# Altium schematic sheet Analog Front End.SchDoc
size A3; Author: Jean Callus; CompanyName: RATON; DrawnBy: Jean Callus; Organization: RATON; Revision: 0; SheetNumber: 4; SheetTotal: 4; ImagePath: C:\Users\callu\Documents\University\Thesis\Misc\UoMLogo.jpg
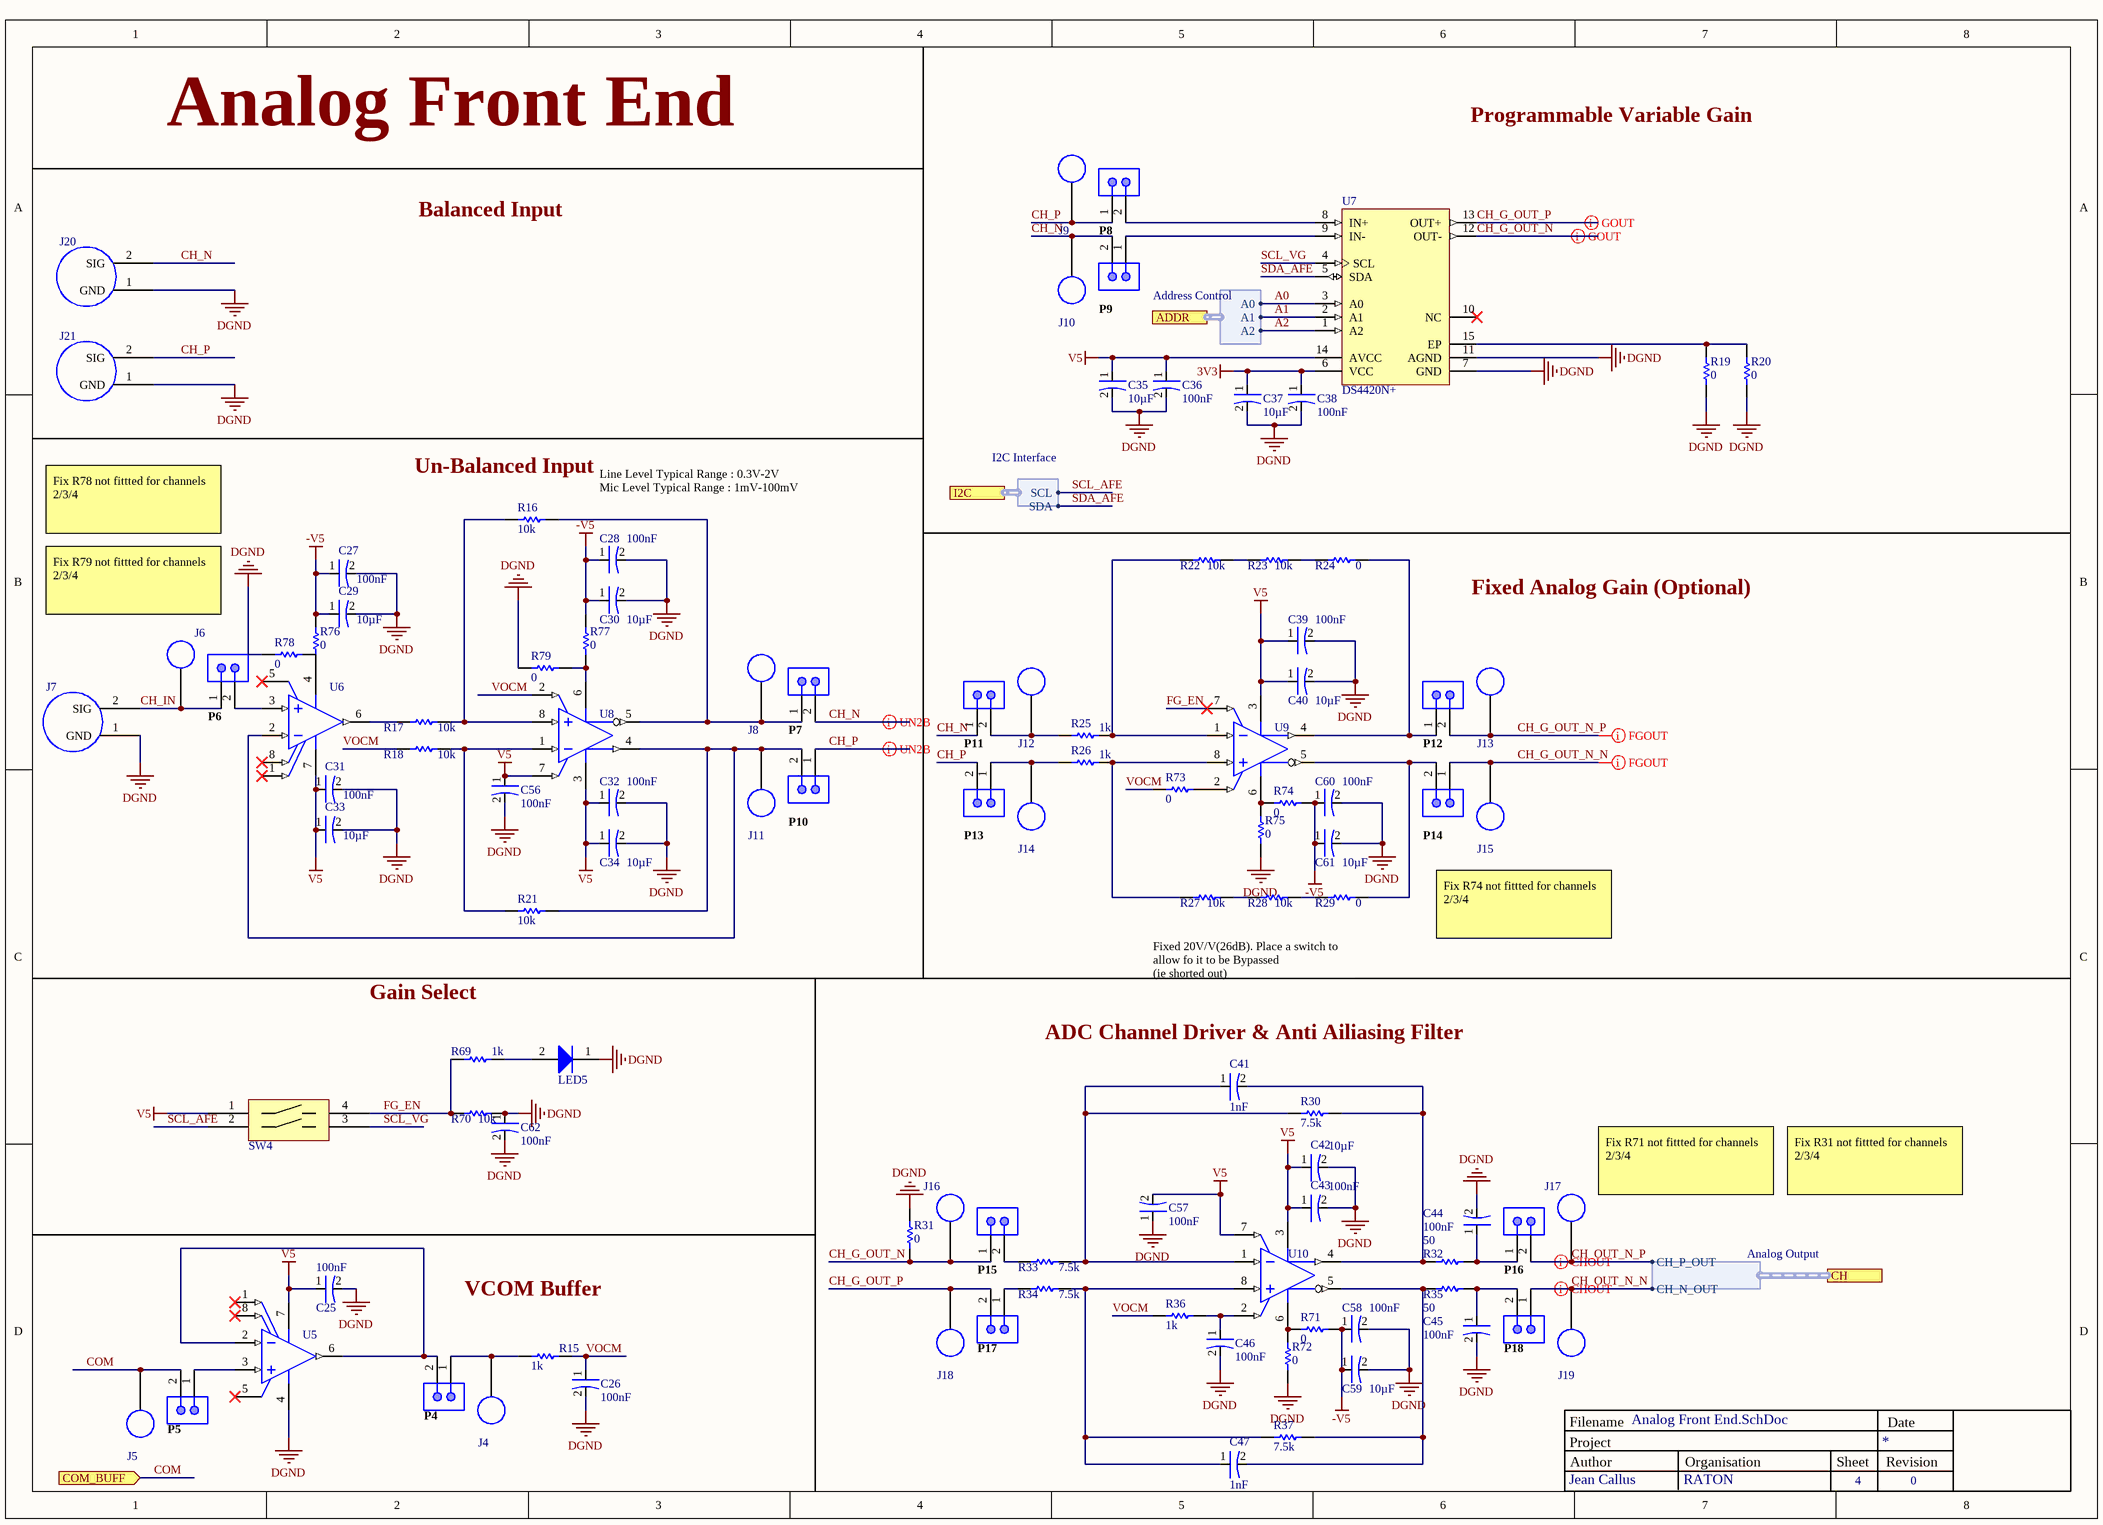
[diagram p0: Analog Front End.SchDoc]

## Parts
C25  value 100nF  [0805-M]  (hidden comment: CAP 0.1uF CER 0805 50V  X7R 5%)
C26  value 100nF  [0805-M]  (hidden comment: CAP 0.1uF CER 0805 50V  X7R 5%)
C27  value 100nF  [0805-M]  (hidden comment: CAP 0.1uF CER 0805 50V  X7R 5%)
C28  value 100nF  [0805-M]  (hidden comment: CAP 0.1uF CER 0805 50V  X7R 5%)
C29  value 10µF  [0805-M]  (hidden comment: CAP 10uF CER 0805 25V X5R 10%)
C30  value 10µF  [0805-M]  (hidden comment: CAP 10uF CER 0805 25V X5R 10%)
C31  value 100nF  [0805-M]  (hidden comment: CAP 0.1uF CER 0805 50V  X7R 5%)
C32  value 100nF  [0805-M]  (hidden comment: CAP 0.1uF CER 0805 50V  X7R 5%)
C33  value 10µF  [0805-M]  (hidden comment: CAP 10uF CER 0805 25V X5R 10%)
C34  value 10µF  [0805-M]  (hidden comment: CAP 10uF CER 0805 25V X5R 10%)
C35  value 10µF  [0805-M]  (hidden comment: CAP 10uF CER 0805 25V X5R 10%)
C36  value 100nF  [0805-M]  (hidden comment: CAP 0.1uF CER 0805 50V  X7R 5%)
C37  value 10µF  [0805-M]  (hidden comment: CAP 10uF CER 0805 25V X5R 10%)
C38  value 100nF  [0805-M]  (hidden comment: CAP 0.1uF CER 0805 50V  X7R 5%)
C39  value 100nF  [0805-M]  (hidden comment: CAP 0.1uF CER 0805 50V  X7R 5%)
C40  value 10µF  [0805-M]  (hidden comment: CAP 10uF CER 0805 25V X5R 10%)
C41  value 1nF  [0805-M]  (hidden comment: CAP 1nF CER 0805 25V X7R 5%)
C42  value 10µF  [0805-M]  (hidden comment: CAP 10uF CER 0805 25V X5R 10%)
C43  value 100nF  [0805-M]  (hidden comment: CAP 0.1uF CER 0805 50V  X7R 5%)
C44  value 100nF  [0805-M]  (hidden comment: CAP 0.1uF CER 0805 50V  X7R 5%)
C45  value 100nF  [0805-M]  (hidden comment: CAP 0.1uF CER 0805 50V  X7R 5%)
C46  value 100nF  [0805-M]  (hidden comment: CAP 0.1uF CER 0805 50V  X7R 5%)
C47  value 1nF  [0805-M]  (hidden comment: CAP 1nF CER 0805 25V X7R 5%)
C56  value 100nF  [0805-M]  (hidden comment: CAP 0.1uF CER 0805 50V  X7R 5%)
C57  value 100nF  [0805-M]  (hidden comment: CAP 0.1uF CER 0805 50V  X7R 5%)
C58  value 100nF  [0805-M]  (hidden comment: CAP 0.1uF CER 0805 50V  X7R 5%)
C59  value 10µF  [0805-M]  (hidden comment: CAP 10uF CER 0805 25V X5R 10%)
C60  value 100nF  [0805-M]  (hidden comment: CAP 0.1uF CER 0805 50V  X7R 5%)
C61  value 10µF  [0805-M]  (hidden comment: CAP 10uF CER 0805 25V X5R 10%)
C62  value 100nF  [0805-M]  (hidden comment: CAP 0.1uF CER 0805 50V  X7R 5%)
J4  151-203-RC  [151-203-RC-Footprint-1]  (value not drawn)
J5  151-203-RC  [151-203-RC-Footprint-1]  (value not drawn)
J6  151-203-RC  [151-203-RC-Footprint-1]  (value not drawn)
J7  SMA CONNECTOR  [SMA CONNECTOR-Footprint-1]  (value not drawn)
J8  151-203-RC  [151-203-RC-Footprint-1]  (value not drawn)
J9  151-203-RC  [151-203-RC-Footprint-1]  (value not drawn)
J10  151-203-RC  [151-203-RC-Footprint-1]  (value not drawn)
J11  151-203-RC  [151-203-RC-Footprint-1]  (value not drawn)
J12  151-203-RC  [151-203-RC-Footprint-1]  (value not drawn)
J13  151-203-RC  [151-203-RC-Footprint-1]  (value not drawn)
J14  151-203-RC  [151-203-RC-Footprint-1]  (value not drawn)
J15  151-203-RC  [151-203-RC-Footprint-1]  (value not drawn)
J16  151-203-RC  [151-203-RC-Footprint-1]  (value not drawn)
J17  151-203-RC  [151-203-RC-Footprint-1]  (value not drawn)
J18  151-203-RC  [151-203-RC-Footprint-1]  (value not drawn)
J19  151-203-RC  [151-203-RC-Footprint-1]  (value not drawn)
J20  SMA CONNECTOR  [SMA CONNECTOR-Footprint-1]  (value not drawn)
J21  SMA CONNECTOR  [SMA CONNECTOR-Footprint-1]  (value not drawn)
LED5  LED 0603 Red 20mA 1.7V  [0603 Generic]  (value not drawn)
P4  GENERIC 2PIN HEADER MALE  [GENERIC 2PIN HEADER 0]  (value not drawn)
P5  GENERIC 2PIN HEADER MALE  [GENERIC 2PIN HEADER 0]  (value not drawn)
P6  GENERIC 2PIN HEADER MALE  [GENERIC 2PIN HEADER 0]  (value not drawn)
P7  GENERIC 2PIN HEADER MALE  [GENERIC 2PIN HEADER 0]  (value not drawn)
P8  GENERIC 2PIN HEADER MALE  [GENERIC 2PIN HEADER 0]  (value not drawn)
P9  GENERIC 2PIN HEADER MALE  [GENERIC 2PIN HEADER 0]  (value not drawn)
P10  GENERIC 2PIN HEADER MALE  [GENERIC 2PIN HEADER 0]  (value not drawn)
P11  GENERIC 2PIN HEADER MALE  [GENERIC 2PIN HEADER 0]  (value not drawn)
P12  GENERIC 2PIN HEADER MALE  [GENERIC 2PIN HEADER 0]  (value not drawn)
P13  GENERIC 2PIN HEADER MALE  [GENERIC 2PIN HEADER 0]  (value not drawn)
P14  GENERIC 2PIN HEADER MALE  [GENERIC 2PIN HEADER 0]  (value not drawn)
P15  GENERIC 2PIN HEADER MALE  [GENERIC 2PIN HEADER 0]  (value not drawn)
P16  GENERIC 2PIN HEADER MALE  [GENERIC 2PIN HEADER 0]  (value not drawn)
P17  GENERIC 2PIN HEADER MALE  [GENERIC 2PIN HEADER 0]  (value not drawn)
P18  GENERIC 2PIN HEADER MALE  [GENERIC 2PIN HEADER 0]  (value not drawn)
R15  value 1k  [0805-M]  (hidden comment: RES 1k 0805 125mW 5%)
R16  value 10k  [0402-M]  (hidden comment: RES 10k 0402 63mW 5%)
R17  value 10k  [0402-M]  (hidden comment: RES 10k 0402 63mW 5%)
R18  value 10k  [0402-M]  (hidden comment: RES 10k 0402 63mW 5%)
R19  value 0  [0402-M]  (hidden comment: RES 0 0402 63mW)
R20  value 0  [0402-M]  (hidden comment: RES 0 0402 63mW)
R21  value 10k  [0402-M]  (hidden comment: RES 10k 0402 63mW 5%)
R22  value 10k  [0805-M]  (hidden comment: RES 10k 0805 125mW 1%)
R23  value 10k  [0805-M]  (hidden comment: RES 10k 0805 125mW 1%)
R24  value 0  [0402-M]  (hidden comment: RES 0 0402 63mW)
R25  value 1k  [0805-M]  (hidden comment: RES 1k 0805 125mW 5%)
R26  value 1k  [0805-M]  (hidden comment: RES 1k 0805 125mW 5%)
R27  value 10k  [0805-M]  (hidden comment: RES 10k 0805 125mW 1%)
R28  value 10k  [0805-M]  (hidden comment: RES 10k 0805 125mW 1%)
R29  value 0  [0402-M]  (hidden comment: RES 0 0402 63mW)
R30  value 7.5k  [0402-M]  (hidden comment: RES 7.5k 0402 63mW 5%)
R31  value 0  [0402-M]  (hidden comment: RES 0 0402 63mW)
R32  value 50  [0805-L]  (hidden comment: RES 50 0805 125mW 1%)
R33  value 7.5k  [0402-M]  (hidden comment: RES 7.5k 0402 63mW 5%)
R34  value 7.5k  [0402-M]  (hidden comment: RES 7.5k 0402 63mW 5%)
R35  value 50  [0805-L]  (hidden comment: RES 50 0805 125mW 1%)
R36  value 1k  [0805-M]  (hidden comment: RES 1k 0805 125mW 5%)
R37  value 7.5k  [0402-M]  (hidden comment: RES 7.5k 0402 63mW 5%)
R69  value 1k  [0805-M]  (hidden comment: RES 1k 0805 125mW 5%)
R70  value 10k  [0805-M]  (hidden comment: RES 10k 0805 125mW 1%)
R71  value 0  [0402-M]  (hidden comment: RES 0 0402 63mW)
R72  value 0  [0402-M]  (hidden comment: RES 0 0402 63mW)
R73  value 0  [0402-M]  (hidden comment: RES 0 0402 63mW)
R74  value 0  [0402-M]  (hidden comment: RES 0 0402 63mW)
R75  value 0  [0402-M]  (hidden comment: RES 0 0402 63mW)
R76  value 0  [0402-M]  (hidden comment: RES 0 0402 63mW)
R77  value 0  [0402-M]  (hidden comment: RES 0 0402 63mW)
R78  value 0  [0402-M]  (hidden comment: RES 0 0402 63mW)
R79  value 0  [0402-M]  (hidden comment: RES 0 0402 63mW)
SW4  210-2MS  [210-2MS-Footprint-1]  (value not drawn)
U5  OPA227UA/2K5  [D0008A_L]  (value not drawn)
U6  OPA227UA/2K5  [D0008A_L]  (value not drawn)
U7  DS4420N+  [QFN50P400X300X75_HS-15N]
U8  OPA1632DR  [D0008A_L]  (value not drawn)
U9  OPA1632DR  [D0008A_L]  (value not drawn)
U10  OPA1632DR  [D0008A_L]  (value not drawn)

## Ports
ADDR (harness Address Control), CH (harness Analog Output), COM_BUFF (in), I2C (harness I2C Interface)

## Harnesses
Analog Output: CH_P_OUT, CH_N_OUT
Address Control: A0, A1, A2
I2C Interface: SCL, SDA

## Nets
3V3: C37.1(Anode) C38.1(Anode) U7.6(VCC)
-V5: C27.1(Anode) C28.1(Anode) C29.1(Anode) C30.1(Anode) C58.1(Anode) C59.1(Anode) C60.1(Anode) C61.1(Anode) R71.2 R74.1 R76.1 R77.2
DGND: C25.2(Cathode) C26.2(Cathode) C27.2(Cathode) C28.2(Cathode) C29.2(Cathode) C30.2(Cathode) C31.2(Cathode) C32.2(Cathode) C33.2(Cathode) C34.2(Cathode) C35.2(Cathode) C36.2(Cathode) C37.2(Cathode) C38.2(Cathode) C39.2(Cathode) C40.2(Cathode) C42.2(Cathode) C43.2(Cathode) C44.2(Cathode) C45.2(Cathode) C46.2(Cathode) C56.2(Cathode) C57.1(Anode) C58.2(Cathode) C59.2(Cathode) C60.2(Cathode) C61.2(Cathode) C62.1(Anode) C62.2(Cathode) J7.1(GND) J20.1(GND) J21.1(GND) LED5.1 R19.1 R20.1 R31.1 R70.2 R72.1 R75.2 R78.1 R79.1 U5.4(V-) U7.7(GND) U7.11(AGND)
V5: C25.1(Anode) C31.1(Anode) C32.1(Anode) C33.1(Anode) C34.1(Anode) C35.1(Anode) C36.1(Anode) C39.1(Anode) C40.1(Anode) C42.1(Anode) C43.1(Anode) C56.1(Anode) C57.2(Cathode) SW4.1 U5.7(V+) U6.7(V+) U7.14(AVCC) U8.3(V+) U8.7(ENABLE) U9.3(V+) U10.3(V+) U10.7(ENABLE)
A0: U7.3(A0) ; port ADDR.A0
A1: U7.2(A1) ; port ADDR.A1
A2: U7.1(A2) ; port ADDR.A2
CH_G_OUT_N: J16.1 P15.1 R31.2 U7.12(OUT-)
CH_G_OUT_N_N: J15.1 P14.1
CH_G_OUT_N_P: J13.1 P12.2
CH_G_OUT_P: J18.1 P17.2 U7.13(OUT+)
CH_IN: J6.1 J7.2(SIG) P6.1
CH_N: J10.1 J20.2(SIG) P7.2 P9.2 P11.1
CH_OUT_N_N: J19.1 P18.1 ; port CH.CH_N_OUT
CH_OUT_N_P: J17.1 P16.2 ; port CH.CH_P_OUT
CH_P: J9.1 J21.2(SIG) P8.1 P10.1 P13.2
COM: J5.1 P5.2 ; port COM_BUFF
FG_EN: R69.1 R70.1 SW4.4 U9.7(ENABLE)
SCL_AFE: SW4.2 ; port I2C.SCL
SCL_VG: SW4.3 U7.4(SCL)
SDA_AFE: U7.5(SDA) ; port I2C.SDA
VOCM: C26.1(Anode) R15.2 R18.1 R36.1 R73.2 U8.2(VOCM)
NetC41_1: C41.1(Anode) R30.1 R33.2 U10.1(VIN-)
NetC41_2: C41.2(Cathode) R30.2 R32.1 U10.4(VOUT+)
NetC44_1: C44.1(Anode) P16.1 R32.2
NetC45_1: C45.1(Anode) P18.2 R35.2
NetC46_1: C46.1(Anode) R36.2 U10.2(VOCM)
NetC47_1: C47.1(Anode) R34.2 R37.1 U10.8(VIN+)
NetC47_2: C47.2(Cathode) R35.1 R37.2 U10.5(VOUT-)
NetJ4_1: J4.1 P4.1 R15.1
NetJ8_1: J8.1 P7.1 R16.2 U8.5(VOUT-)
NetJ11_1: J11.1 P10.2 R21.2 U6.2(IN-) U8.4(VOUT+)
NetJ12_1: J12.1 P11.2 R25.2
NetJ14_1: J14.1 P13.1 R26.2
NetLED5_2: LED5.2 R69.2
NetP4_2: P4.2 U5.2(IN-) U5.6(OUT)
NetP5_1: P5.1 U5.3(IN+)
NetP6_2: P6.2 U6.3(IN+)
NetP8_2: P8.2 U7.8(IN+)
NetP9_1: P9.1 U7.9(IN-)
NetP12_1: P12.1 R24.2 U9.4(VOUT+)
NetP14_2: P14.2 R29.2 U9.5(VOUT-)
NetP15_2: P15.2 R33.1
NetP17_1: P17.1 R34.1
NetR16_1: R16.1 R17.2 U8.8(VIN+)
NetR17_1: R17.1 U6.6(OUT)
NetR18_2: R18.2 R21.1 U8.1(VIN-)
NetR19_2: R19.2 R20.2 U7.15(EP)
NetR22_1: R22.1 R25.1 U9.1(VIN-)
NetR22_2: R22.2 R23.1
NetR23_2: R23.2 R24.1
NetR26_1: R26.1 R27.1 U9.8(VIN+)
NetR27_2: R27.2 R28.1
NetR28_2: R28.2 R29.1
NetR71_1: R71.1 R72.2 U10.6(V-)
NetR73_1: R73.1 U9.2(VOCM)
NetR74_2: R74.2 R75.1 U9.6(V-)
NetR76_2: R76.2 U6.4(V-)
NetR77_1: R77.1 R79.2 U8.6(V-)

Not connected (* = marked no-connect by the designer): R78 2; U5 1(TRIM)* 5(NC)* 8(TRIM)*; U6 1(TRIM)* 5(NC)* 8(TRIM)*; U7 10(NC)*

## Layout directives
differential pair: CH_G_OUT_N, CH_G_OUT_N_N, CH_G_OUT_N_P, CH_G_OUT_P, CH_N, CH_OUT_N_N, CH_OUT_N_P, CH_P

## Notes on the sheet
- Analog Front End
- Programmable Variable Gain
- Balanced Input
- (near R16) Un-Balanced Input
- Fix R78 not fittted for channels 2/3/4
- Line Level Typical Range : 0.3V-2V
  Mic Level Typical Range : 1mV-100mV
- Fixed Analog Gain (Optional)
- Fix R79 not fittted for channels 2/3/4
- Fix R74 not fittted for channels 2/3/4
- Gain Select
- Fixed 20V/V(26dB). Place a switch to allow fo it to be Bypassed
  (ie shorted out)
- (near C41) ADC Channel Driver & Anti Ailiasing Filter
- (near J17) Fix R71 not fittted for channels 2/3/4
- Fix R31 not fittted for channels 2/3/4
- VCOM Buffer
- Project
- Filename
- Author
- Organisation
- Sheet
- Revision
- Date
  Date

## Library data of the parts
C25-C28 C31 C32 C36 C38 C39 C43-C46 C56-C58 C60 C62 = CAP 0.1uF CER 0805 50V  X7R 5%-2: CAP-0.1uF-CER-0805-50V- X7R-5%; Manufacturer: Generic; Bin: F1-C6-4; Type: SMD; Design Item ID: CAP 0.1uF CER 0805 50V  X7R 5%; Supplier 1: Mouser; Datasheet: http://www.kemet.com/Lists/ProductCatalog/Attachments/53/KEM_C1002_X7R_SMD.pdf; Source: Capacitor Library.SchLib; Case/Package: 0805; Status: Active; Supplier Part Number 1: 80-C0805C104J3R
C29 C30 C33-C35 C37 C40 C42 C59 C61 = CAP 10uF CER 0805 25V X5R 10%-2: CAP-10uF-CER-0805-25V-X5R-10%; Manufacturer: Generic; Type: SMD; Bin: F1-C1-4; Supplier 1: Mouser; Case/Package: 0805; Source: Capacitor Library.SchLib; Supplier Part Number 1: 80-C0805C106K8P; Status: Active; Design Item ID: CAP 10uF CER 0805 25V X5R 10%
C41 C47 = CAP 1nF CER 0805 25V X7R 5%-2: Manufacturer: Generic; Bin: N; Type: SMD; Source: Capacitor Library.SchLib; Datasheet: http://www.mouser.com/ds/2/212/KEM_C1002_X7R_SMD-357932.pdf; Supplier 1: Mouser; Status: Active; Design Item ID: CAP 1nF CER 0805 25V X7R 5%; Supplier Part Number 1: 77-VJ0805Y102JXXPBC; Case/Package: 0805
J4-J6 J8-J19 = CMP-002-00000-2: PCB-Probe-Ring; Color: Black
J7 J20 J21 = CMP-002-00001-2: Manufacturer: LPRS; Connector Type: SMA,Coaxial; Max Frequency: 6GHz; Impedance: 50R; Supplier No: 471-SMACONNECTOR; Contact Material: Gold; Supplier: Mouser; REACH SVHC: No SVHC; Case/Package: SMA; Contact Plating: Gold
LED5 = LED 0603 Red 20mA 1.7V-1: LED-0603-Red-20mA-1.7V-STOCK; Manufacturer: Generic; Bin: F2-DM1-2; Type: SMD; Supplier Part Number 1: 67-1551-6-ND; Design Item ID: LED 0603 Red 20mA 1.7V; Status: Active; Case/Package: 0603; Source: Diode Library.SchLib; Supplier 1: Digi-Key
P4-P18 = GENERIC 2PIN HEADER MALE-2: CONN MAL TH 2 0Deg HEADER; Bin: B3-J5; Manufacturer: Generic; Design Item ID: GENERIC 2PIN HEADER MALE; Type: TH; Status: Active; Source: Connector Library.SchLib; Case/Package: n/a PIN
R15 R25 R26 R36 R69 = RES 1k 0805 125mW 5%-1: RES-1k-0805-125mW-5%; Manufacturer: Generic; Bin: F1-R12-6; MAPPING: 1(2,1,30.9k); Design Item ID: RES 1k 0805 125mW 5%; Case/Package: 0805; Status: Active; Source: Resistor Library.SchLib; Type: SMD
R16-R18 R21 = RES 10k 0402 63mW 5%-1: RES-10k-0402-63mW-5%; Manufacturer: Generic; Bin: F1-R7-9; MAPPING: 1(2,1,11.5k); Design Item ID: RES 10k 0402 63mW 5%; Type: SMD; Status: Active; Case/Package: 0402; Source: Resistor Library.SchLib
R19 R20 R24 R29 R31 R71-R79 = RES 0 0402 63mW-1: RES-0-0402-63mW-5%; Manufacturer: Generic; MAPPING: 1(2,1,11.5k); Bin: F1-RM1-5; Source: Resistor Library.SchLib; Design Item ID: RES 0 0402 63mW; Case/Package: 0402; Type: SMD; Status: Active
R22 R23 R27 R28 R70 = RES 10k 0805 125mW 1%-1: RES-10k-0805-125mW-1%; Manufacturer: Generic; MAPPING: 1(2,1,10k); Bin: F1-R12-10; Design Item ID: RES 10k 0805 125mW 1%; Case/Package: 0805; Type: SMD; Status: Active; Source: Resistor Library.SchLib
R30 R33 R34 R37 = RES 7.5k 0402 63mW 5%-1: RES-7.5k-0402-63mW-5%; Manufacturer: Generic; Bin: F1-R3-1; MAPPING: 1(2,1,11.5k); Type: SMD; Status: Active; Case/Package: 0402; Design Item ID: RES 7.5k 0402 63mW 5%; Source: Resistor Library.SchLib
R32 R35 = RES 50 0805 125mW 1%-1: RES-50-0805-125mW-1%; Manufacturer: Generic; MAPPING: 1(2,1,30.9k); Bin: F1-R9-6; Design Item ID: RES 50 0805 125mW 1%; Case/Package: 0805; Type: SMD; Status: Active; Source: Resistor Library.SchLib
SW4 = CMP-01293-3: SWITCH DIP SPST 2 100mA 50V; Actuator Type: Slide (Standard); Electrical Life: 1000Cycles; Number of Positions: 2; Washable: No; Pitch: 0.1inch; Voltage Rating (DC): 20V; Terminal Pitch: 2.54mm; Contact Material: Copper; Length: 0.258inch; Termination: PC Pin; Lead Free: Lead Free; Max Current Rating: 100mA; Throw Configuration: SPST; Packaging: Rail/Tube; Current Rating: 100mA; Orientation: Straight; Min Operating Temperature: -40°C; Contact Plating: Gold,Tin; Max Operating Temperature: 85°C; Package Quantity: 85; Mount: Through Hole
U5 U6 = CMP-019-00001-1: IC OPAMP GP 8MHZ 8SOIC; Slew Rate: 2.3V/µs; Input Bias Current: 10nA; Max Supply Voltage: 18V; Input Offset Voltage (Vos): 200uV; Operating Supply Current: 3.7mA; Number of Circuits: 1; Output Current per Channel: 45mA; Nominal Supply Current: 3.8mA; Common Mode Rejection Ratio: 120dB; Voltage Gain: 160dB; Power Supply Rejection Ratio (PSRR): 126.02dB; Min Dual Supply Voltage: 2.5V; Number of Pins: 8; Radiation Hardening: No; Max Dual Supply Voltage: 18V; Packaging: Tape and Reel; Max I/O Voltage: 200uV; Contact Plating: Gold; Number of Channels: 1; Case/Package: D; Gain Bandwidth Product: 8MHz; Min Operating Temperature: -40°C; Nominal Gain Bandwidth Product: 8MHz; Max Operating Temperature: 85°C; Unity Gain Bandwidth Product: 8MHz; Output Current: 45mA; Bandwidth: 8MHz; Package Quantity: 2500; Number of Elements: 1; Lead Free: Lead Free
U7 = CMP-01300-2: Maxim DS4420N+, Programmable Gain Amplifier 67dB, 14-Pin TDFN; Bandwidth: 20kHz; Min Supply Voltage: 4.5V; Power Supply Rejection Ratio (PSRR): 90dB; Number of Amplifiers: 1; Nominal Supply Current: 1.7mA; Max Supply Voltage: 5.5V; Length: 3mm; REACH SVHC: Unknown; Features: I²C; Packaging: Rail/Tube; Height: 0.75mm; Radiation Hardening: No; Min Operating Temperature: -20°C; Width: 3mm; Max Operating Temperature: 70°C; Package Quantity: 100; Number of Pins: 14
U8-U10 = CMP-019-00002-1: IC OPAMP AUDIO 180MHZ 8SOIC; Operating Supply Current: 14mA; Min Supply Voltage: 5V; Voltage Gain: 78dB; Max Supply Voltage: 32V; Max Dual Supply Voltage: 16V; Number of Circuits: 1; Output Current: 85mA; Power Supply Rejection Ratio (PSRR): 70dB; Input Offset Voltage (Vos): 3mV; Min Dual Supply Voltage: 2.5V; Common Mode Rejection Ratio: 74dB; Slew Rate: 50V/µs; Dual Supply Voltage: 15V; Max Power Dissipation: 2W; Input Bias Current: 2uA; Supply Type: Single,Dual; Gain Bandwidth Product: 180MHz; Package Quantity: 2500; Case/Package: D; Bandwidth: 180MHz; Nominal Gain Bandwidth Product: 180MHz; -3db Bandwidth: 180MHz; Number of Pins: 8; Number of Elements: 1; Output Current per Channel: 85mA; Radiation Hardening: No; Number of Channels: 1; Nominal Supply Current: 14mA; Gain: 78dB; Max Operating Temperature: 85°C; Weight: 0.002677oz; Packaging: Tape and Reel; Min Operating Temperature: -40°C; Lead Free: Lead Free; Contact Plating: Gold